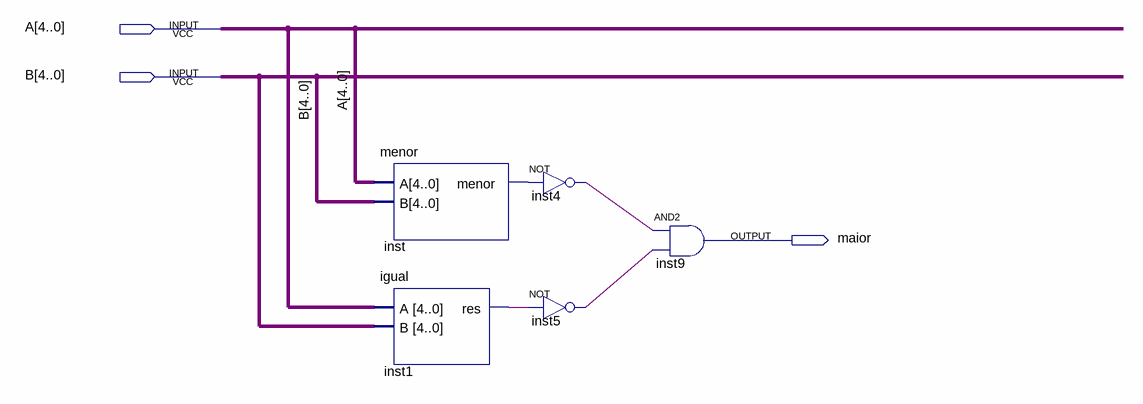
[diagram p0: schematic sheet]
// Quartus schematic maior.bdf as structural Verilog: 5 symbols, 3 pins
module maior (
  input  [4:0] A,
  input  [4:0] B,
  output maior
);

  wire inst1_res, inst4_out, inst5_out, inst_menor;

  menor inst (.A(A), .B(B), .menor(inst_menor));
  igual inst1 (.A(A), .B(B), .res(inst1_res));
  not inst4 (inst4_out, inst_menor);
  not inst5 (inst5_out, inst1_res);
  and inst9 (maior, inst4_out, inst5_out);
endmodule
